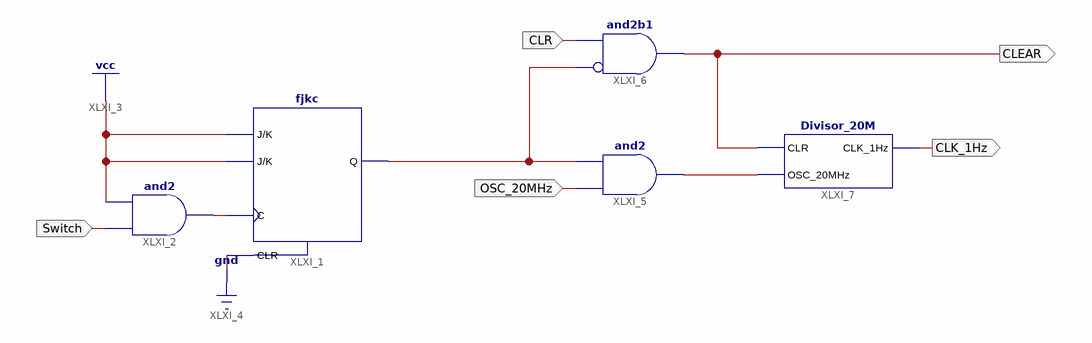
[diagram p0: schematic sheet 1]
// Xilinx ISE schematic Controller.sch (spartan6) as structural Verilog: 5 symbols, 5 ports
module Controller (
  input  Switch,
  input  OSC_20MHz,
  input  CLR,
  output CLEAR,
  output CLK_1Hz
);

  wire XLXN_1, XLXN_7, XLXN_10;

  fjkc XLXI_1 (.C(XLXN_1), .CLR(1'b0), .J(1'b1), .K(1'b1), .Q(XLXN_7));
  and XLXI_2 (XLXN_1, Switch, 1'b1);
  and XLXI_5 (XLXN_10, OSC_20MHz, XLXN_7);
  and XLXI_6 (CLEAR, ~XLXN_7, CLR);  // and2b1
  Divisor_20M XLXI_7 (.CLR(CLEAR), .OSC_20MHz(XLXN_10), .CLK_1Hz(CLK_1Hz));
endmodule
